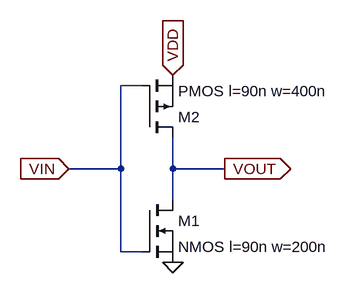
[diagram p0: schematic inverter.asc]
inverter.asc, the LTspice schematic file:
Version 4
SHEET 1 880 680
WIRE 192 16 160 16
WIRE 160 144 160 16
WIRE 160 144 80 144
WIRE 240 144 240 96
WIRE 320 144 240 144
WIRE 240 192 240 144
WIRE 160 272 160 144
WIRE 192 272 160 272
FLAG 240 288 0
FLAG 80 144 VIN
IOPIN 80 144 In
FLAG 240 0 VDD
IOPIN 240 0 In
FLAG 320 144 VOUT
IOPIN 320 144 Out
SYMBOL nmos 192 192 R0
SYMATTR InstName M1
SYMATTR Value NMOS l=90n w=200n
SYMBOL pmos 192 96 M180
SYMATTR InstName M2
SYMATTR Value PMOS l=90n w=400n

The netlist it stands for:
* inverter.asc
M1 VOUT VIN 0 0 NMOS l=90n w=200n
M2 VOUT VIN VDD VDD PMOS l=90n w=400n
.model NMOS NMOS
.model PMOS PMOS
.lib standard.mos
.backanno
.end